# Altium project Arduino_VFO.PrjPcb
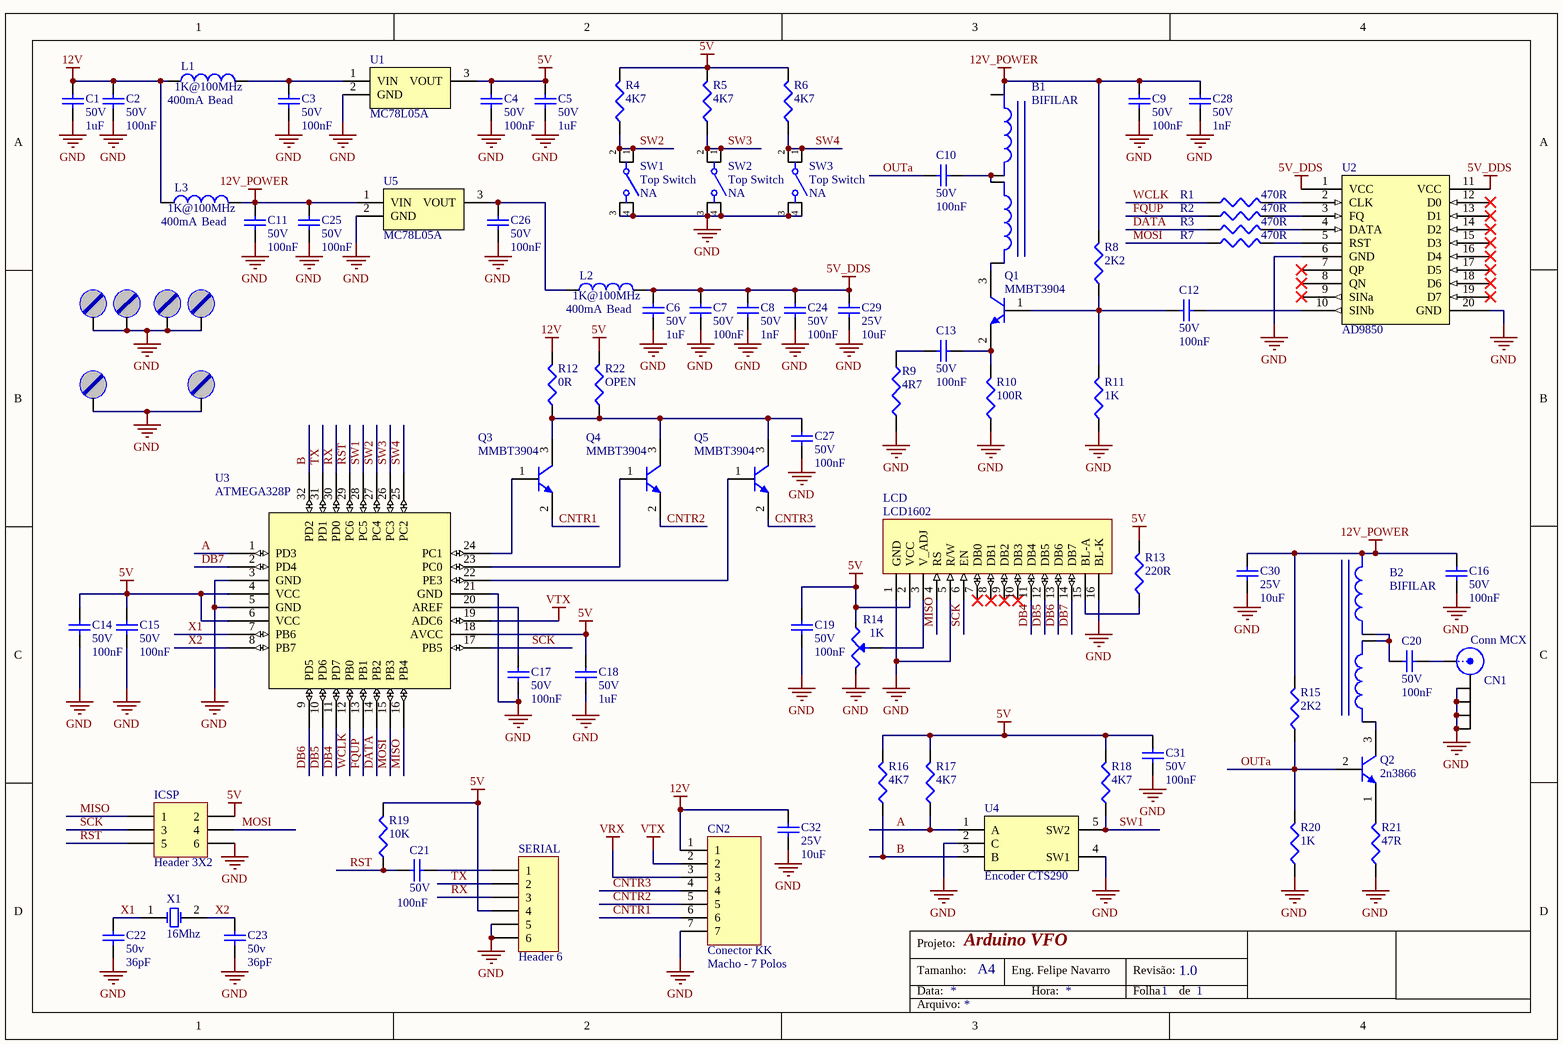
[diagram p0: Arduino.SchDoc]
1 sheet, 84 parts. Net scope: global (net labels, ports and power ports of the same name join across sheets).
Board file: Arduino_VFO.PcbDoc

## Sheet Arduino.SchDoc: Arduino VFO
size A4; Organization: Altium Limited; Address1: L3, 12a Rodborough Rd; Address2: Frenchs Forest; Address3: NSW; Address4: Australia 2086; Revision: 1.0; SheetNumber: 1; SheetTotal: 1

### Parts
B1  BIFILAR  [Toroid Bifilar]
B2  BIFILAR  [Toroid Bifilar]
C1  value 1uF  Tensão: 50V  [CC0603]  (hidden comment: Capacitor Cerâmico)
C2  value 100nF  Tensão: 50V  [CC0603]  (hidden comment: Capacitor Cerâmico)
C3  value 100nF  Tensão: 50V  [CC0603]  (hidden comment: Capacitor Cerâmico)
C4  value 100nF  Tensão: 50V  [CC0603]  (hidden comment: Capacitor Cerâmico)
C5  value 1uF  Tensão: 50V  [CC0603]  (hidden comment: Capacitor Cerâmico)
C6  value 1uF  Tensão: 50V  [CC0603]  (hidden comment: Capacitor Cerâmico)
C7  value 100nF  Tensão: 50V  [CC0603]  (hidden comment: Capacitor Cerâmico)
C8  value 1nF  Tensão: 50V  [CC0603]  (hidden comment: Capacitor Cerâmico)
C9  value 100nF  Tensão: 50V  [CC0603]  (hidden comment: Capacitor Cerâmico)
C10  value 100nF  Tensão: 50V  [CC0603]  (hidden comment: Capacitor Cerâmico)
C11  value 100nF  Tensão: 50V  [CC0603]  (hidden comment: Capacitor Cerâmico)
C12  value 100nF  Tensão: 50V  [CC0603]  (hidden comment: Capacitor Cerâmico)
C13  value 100nF  Tensão: 50V  [CC0603]  (hidden comment: Capacitor Cerâmico)
C14  value 100nF  Tensão: 50V  [CC0603]  (hidden comment: Capacitor Cerâmico)
C15  value 100nF  Tensão: 50V  [CC0603]  (hidden comment: Capacitor Cerâmico)
C16  value 100nF  Tensão: 50V  [CC0603]  (hidden comment: Capacitor Cerâmico)
C17  value 100nF  Tensão: 50V  [CC0603]  (hidden comment: Capacitor Cerâmico)
C18  value 1uF  Tensão: 50V  [CC0603]  (hidden comment: Capacitor Cerâmico)
C19  value 100nF  Tensão: 50V  [CC0603]  (hidden comment: Capacitor Cerâmico)
C20  value 100nF  Tensão: 50V  [CC0603]  (hidden comment: Capacitor Cerâmico)
C21  value 100nF  Tensão: 50V  [CC0603]  (hidden comment: Capacitor Cerâmico)
C22  value 36pF  Tensão: 50v  [CC0603]  (hidden comment: Capacitor Cerâmico)
C23  value 36pF  Tensão: 50v  [CC0603]  (hidden comment: Capacitor Cerâmico)
C24  value 100nF  Tensão: 50V  [CC0603]  (hidden comment: Capacitor Cerâmico)
C25  value 100nF  Tensão: 50V  [CC0603]  (hidden comment: Capacitor Cerâmico)
C26  value 100nF  Tensão: 50V  [CC0603]  (hidden comment: Capacitor Cerâmico)
C27  value 100nF  Tensão: 50V  [CC0603]  (hidden comment: Capacitor Cerâmico)
C28  value 1nF  Tensão: 50V  [CC0603]  (hidden comment: Capacitor Cerâmico)
C29  value 10uF  Tensão: 25V  [CC0805]  (hidden comment: Capacitor Cerâmico)
C30  value 10uF  Tensão: 25V  [CC0805]  (hidden comment: Capacitor Cerâmico)
C31  value 100nF  Tensão: 50V  [CC0603]  (hidden comment: Capacitor Cerâmico)
C32  value 10uF  Tensão: 25V  [CC0805]  (hidden comment: Capacitor Cerâmico)
CN1  Conn MCX  [CONN MCX MOLEX]
CN2  Conector KK  value Macho - 7 Polos  [CONN HDR7-POL P.100]
ICSP  Header 3X2  [CONN HDR2X3]
L1  Bead  value 1K@100MHz  Corrente: 400mA  [CC0603]
L2  Bead  value 1K@100MHz  Corrente: 400mA  [CC0603]
L3  Bead  value 1K@100MHz  Corrente: 400mA  [CC0603]
LCD  LCD1602  [LCD-1602]
M1  Furo de Fixação  [Furo_M3]  (value not drawn)  (no BOM)
M2  Furo de Fixação  [Furo_M3]  (value not drawn)  (no BOM)
M3  Furo de Fixação  [Furo_M3]  (value not drawn)  (no BOM)
M4  Furo de Fixação  [Furo_M3]  (value not drawn)  (no BOM)
M5  Furo de Fixação  [Furo_M3]  (value not drawn)  (no BOM)
M6  Furo de Fixação  [Furo_M3]  (value not drawn)  (no BOM)
Q1  MMBT3904  [SOT-23-3N]
Q2  2n3866  [TO-92R]
Q3  MMBT3904  [SOT-23-3N]
Q4  MMBT3904  [SOT-23-3N]
Q5  MMBT3904  [SOT-23-3N]
R1  value 470R  [CC0603]  (hidden comment: Resistor)
R2  value 470R  [CC0603]  (hidden comment: Resistor)
R3  value 470R  [CC0603]  (hidden comment: Resistor)
R4  value 4K7  [CC0603]  (hidden comment: Resistor)
R5  value 4K7  [CC0603]  (hidden comment: Resistor)
R6  value 4K7  [CC0603]  (hidden comment: Resistor)
R7  value 470R  [CC0603]  (hidden comment: Resistor)
R8  value 2K2  [CC0603]  (hidden comment: Resistor)
R9  value 4R7  [CC0603]  (hidden comment: Resistor)
R10  value 100R  [CC0603]  (hidden comment: Resistor)
R11  value 1K  [CC0603]  (hidden comment: Resistor)
R12  value 0R  [CC0603]  (hidden comment: Resistor)
R13  value 220R  [CC0603]  (hidden comment: Resistor)
R14  value 1K  [POT]  (hidden comment: Potenciômetro)
R15  value 2K2  [CC0603]  (hidden comment: Resistor)
R16  value 4K7  [CC0603]  (hidden comment: Resistor)
R17  value 4K7  [CC0603]  (hidden comment: Resistor)
R18  value 4K7  [CC0603]  (hidden comment: Resistor)
R19  value 10K  [CC0603]  (hidden comment: Resistor)
R20  value 1K  [CC0603]  (hidden comment: Resistor)
R21  value 47R  [CC0603]  (hidden comment: Resistor)
R22  value OPEN  [CC0603]  (hidden comment: Resistor)
SERIAL  Header 6  [CONN HDR1X6]
SW1  Top Switch  value NA  [SWITCH-TACTIL_6x6]
SW2  Top Switch  value NA  [SWITCH-TACTIL_6x6]
SW3  Top Switch  value NA  [SWITCH-TACTIL_6x6]
U1  MC78L05A  [SOT-89-3N]
U2  AD9850  [AD9850]
U3  ATMEGA328P  [TQFP-32N]
U4  Encoder CTS290  [ENCODER - CTS 290]
U5  MC78L05A  [SOT-89-3N]
X1  16Mhz  [HC/49US]

### Nets
5V: C4.2 C5.2 C14.2 C15.2 C18.2 C19.2 C31.2 ICSP.2 LCD.2(VCC) R4.2 R5.2 R6.2 R13.2 R14.1 R16.2 R17.2 R18.2 R19.2 R22.2 SERIAL.4 U1.3(VOUT) U3.4(VCC) U3.6(VCC) U3.18(AVCC)
5V_DDS: C6.2 C7.2 C8.2 C24.2 C29.2 L2.2 U2.1(VCC) U2.11(VCC)
12V: C1.2 C2.2 C32.2 CN2.1 L1.1 L3.1 R12.2
12V_POWER: B1.1(Pri+) B2.1(Pri+) C9.2 C11.2 C16.2 C25.2 C28.2 C30.2 L3.2 R8.2 R15.2 U5.1(VIN)
GND: C1.1 C2.1 C3.1 C4.1 C5.1 C6.1 C7.1 C8.1 C9.1 C11.1 C14.1 C15.1 C16.1 C17.1 C18.1 C19.1 C22.1 C23.1 C24.1 C25.1 C26.1 C27.1 C28.1 C29.1 C30.1 C31.1 C32.1 CN1.2(Y) CN1.3(Y) CN1.4(Y) CN1.5(Y) CN2.7 ICSP.6 LCD.1(GND) LCD.5(R/W) LCD.16(BL-K) M1.X M2.X M3.X M4.X M5.X M6.X R9.1 R10.1 R11.1 R14.3 R20.1 R21.1 SERIAL.5 SERIAL.6 SW1.3 SW1.4 SW2.3 SW2.4 SW3.3 SW3.4 U1.2(GND) U2.6(GND) U2.20(GND) U3.3(GND) U3.5(GND) U3.21(GND) U4.2(C) U4.4(SW1) U5.2(GND)
VRX: CN2.3
VTX: CN2.2 U3.19(ADC6)
A: R17.1 U3.1(PD3) U4.1(A)
B: R16.1 U3.32(PD2) U4.3(B)
CNTR1: CN2.6 Q3.2(E)
CNTR2: CN2.5 Q4.2(E)
CNTR3: CN2.4 Q5.2(E)
DATA: R3.1 U3.14(PB2)
DB4: LCD.11(DB4) U3.11(PD7)
DB5: LCD.12(DB5) U3.10(PD6)
DB6: LCD.13(DB6) U3.9(PD5)
DB7: LCD.14(DB7) U3.2(PD4)
FQUP: R2.1 U3.13(PB1)
MISO: ICSP.1 LCD.4(RS) U3.16(PB4)
MOSI: ICSP.4 R7.1 U3.15(PB3)
OUTa: C10.2 Q2.2(B) R15.1 R20.2
RST: C21.2 ICSP.5 R19.1 U3.29(PC6)
RX: SERIAL.3 U3.30(PD0)
SCK: ICSP.3 LCD.6(EN) U3.17(PB5)
SW1: R18.1 U3.28(PC5) U4.5(SW2)
SW2: R4.1 SW1.1 SW1.2 U3.27(PC4)
SW3: R5.1 SW2.1 SW2.2 U3.26(PC3)
SW4: R6.1 SW3.1 SW3.2 U3.25(PC2)
TX: SERIAL.2 U3.31(PD1)
WCLK: R1.1 U3.12(PB0)
X1: C22.2 U3.7(PB6) X1.1(OSC1)
X2: C23.2 U3.8(PB7) X1.2(OSC2)
NetB1_2: B1.2(Sec-) B1.3(Sec+) C10.1
NetB1_4: B1.4(Pri-) Q1.3(C)
NetB2_2: B2.2(Sec-) B2.3(Sec+) C20.2
NetB2_4: B2.4(Pri-) Q2.3(C)
NetC3_2: C3.2 L1.2 U1.1(VIN)
NetC12_1: C12.1 U2.10(SINb)
NetC12_2: C12.2 Q1.1(B) R8.1 R11.2
NetC13_1: C13.1 R9.2
NetC13_2: C13.2 Q1.2(E) R10.2
NetC17_2: C17.2 U3.20(AREF)
NetC20_1: C20.1 CN1.1(X)
NetC21_1: C21.1 SERIAL.1
NetC26_2: C26.2 L2.1 U5.3(VOUT)
NetC27_2: C27.2 Q3.3(C) Q4.3(C) Q5.3(C) R12.1 R22.1
NetLCD_3: LCD.3(V_ADJ) R14.2(TAP)
NetLCD_15: LCD.15(BL-A) R13.1
NetQ2_1: Q2.1(E) R21.2
NetQ3_1: Q3.1(B) U3.24(PC1)
NetQ4_1: Q4.1(B) U3.23(PC0)
NetQ5_1: Q5.1(B) U3.22(PE3)
NetR1_2: R1.2 U2.2(CLK)
NetR2_2: R2.2 U2.3(FQ)
NetR3_2: R3.2 U2.4(DATA)
NetR7_2: R7.2 U2.5(RST)

Not connected (* = marked no-connect by the designer): LCD 7(DB0)* 8(DB1)* 9(DB2)* 10(DB3)*; U2 7(QP)* 8(QN)* 9(SINa)* 12(D0)* 13(D1)* 14(D2)* 15(D3)* 16(D4)* 17(D5)* 18(D6)* 19(D7)*

### Notes on the sheet
- Projeto:
- Tamanho:
- Data:
- A4
- Eng. Felipe Navarro
- Hora:
- Revisão:
- Folha
- de
- Arquivo:

### Library data of the parts
B1 B2 = Toroid Bifilar: ChinesePrice: 0,00000; Chinês: ----; Corrente: *; Potência: *; Supplier 1: Digi-Key; Supplier Part Number 1: *; Tensão: *; Obs:: *; Tolerância: *; ComponentLink1Description: Datasheet; ComponentLink1URL: D:\Tecnoclade\Datasheet\!DataMissing.pdf; Substituição: 00/00/0000; Value: *
C1 C5 C6 C18 = Cap 1uF 50V 0603 X5R: Capacitor (Semiconductor SIM Model); Chinês: Local; ChinesePrice: 0,01100; Corrente: *A; Potência: *W; Obs:: X5R; Tolerância: ±10%; Supplier 1: Digi-Key; Supplier Part Number 1: 587-2400-1-ND; ComponentLink1Description: Datasheet; ComponentLink1URL: D:\Tecnoclade\Datasheet\!DataMissing.pdf
C2-C4 C7 C9-C17 C19-C21 C24-C28 C31 = Cap 100nF 50V 0603 X7R: Capacitor (Semiconductor SIM Model); Chinês: Local; ChinesePrice: 0,00250; Corrente: *A; Potência: *W; Obs:: X7R; Tolerância: ±10%; Supplier 1: Digi-Key; Supplier Part Number 1: 1276-1000-1-ND; ComponentLink1Description: Datasheet; ComponentLink1URL: D:\Tecnoclade\Datasheet\!DataMissing.pdf
C8 = Cap 1nF 50V 0603 NP0: Capacitor (Semiconductor SIM Model); Chinês: Local; ChinesePrice: 0,00700; Corrente: *A; Potência: *W; Obs:: NP0; Tolerância: ±5%; Supplier 1: Digi-Key; Supplier Part Number 1: 490-1451-1-ND; ComponentLink1Description: Datasheet; ComponentLink1URL: D:\Tecnoclade\Datasheet\!DataMissing.pdf
C22 C23 = Cap - $Val $V $Footprint $Classe_1: Capacitor (Semiconductor SIM Model); Chinês: ----; ChinesePrice: 0,00000; Corrente: *A; Potência: *W; Tolerância: ±*%; Supplier 1: Digi-Key; Supplier Part Number 1: 1276-1187-1-ND; Obs:: *; ComponentLink1Description: Datasheet; ComponentLink1URL: D:\Tecnoclade\Datasheet\!DataMissing.pdf
C29 C30 C32 = Cap 10uF 25V 0805 X5R: Capacitor (Semiconductor SIM Model); Chinês: Local; ChinesePrice: 0,02620; Corrente: *A; Potência: *W; Obs:: X5R; Tolerância: ±10%; Supplier 1: Digi-Key; Supplier Part Number 1: 587-2985-1-ND; ComponentLink1Description: Datasheet; ComponentLink1URL: D:\Tecnoclade\Datasheet\!DataMissing.pdf
CN1 = Conn MCX: Conector MCX; ChinesePrice: 0,00000; Chinês: ----; Value: SMA; Corrente: *; Potência: *; Supplier 1: Digi-Key; Supplier Part Number 1: WM5541-ND; Tensão: *; Obs:: *; Tolerância: *; ComponentLink1Description: Datasheet; ComponentLink1URL: D:\Tecnoclade\Datasheet\!DataMissing.pdf
CN2 = KK 7P Macho-V P2.54mm: ChinesePrice: 0,00000; Chinês: ----; Corrente: *; Potência: *; Supplier 1: Digi-Key; Supplier Part Number 1: A19472-ND; Tensão: *; Obs:: *; Tolerância: *; ComponentLink1Description: Datasheet; ComponentLink1URL: D:\Tecnoclade\Datasheet\!DataMissing.pdf
ICSP = Header 3X2: Header, 5-Pin, Dual row; ChinesePrice: 0,00000; Chinês: ----; Value: Macho; Obs:: Barra dupla de 40 pinos - ATENÇÃO; Corrente: *; Potência: *; Supplier 1: Digi-Key; Supplier Part Number 1: 609-3724-ND; Tensão: *; Tolerância: *; ComponentLink1Description: Datasheet; ComponentLink1URL: D:\Tecnoclade\Datasheet\!DataMissing.pdf
L1-L3 = Bd 1K@100MHz 0603 400mA: ChinesePrice: 0,00000; Chinês: -----; Obs:: Ferrite (0R5); Tolerância: ±25%; Potência: *; Supplier 1: Digi-Key; Supplier Part Number 1: 445-1550-1-ND; Tensão: *; ComponentLink1Description: Datasheet; ComponentLink1URL: D:\Tecnoclade\Datasheet\!DataMissing.pdf; Substituição: 27/06/2014
LCD = LCD1602: LCD Generico 16 caracteres X 2 linhas; ChinesePrice: 0,00000; Chinês: ----; Tensão: -0V3 ~ 7V; Value: Display LCD de LED; Obs:: BackLigth = 3V ~ 11V (5V recomendado); Corrente: *; Potência: *; Supplier 1: Digi-Key; Supplier Part Number 1: --LCD; Tolerância: *; ComponentLink1Description: Datasheet; ComponentLink1URL: D:\Tecnoclade\Datasheet\
M1-M6 = Parafuso: Furo para parafuso; Value: M3; ChinesePrice: 0,00000; Chinês: ----; Supplier 1: Digi-Key; Supplier Part Number 1: --Del; Corrente: *; Potência: *; Tensão: *; Tolerância: *; Obs:: *; ComponentLink1Description: Datasheet; ComponentLink1URL: D:\Tecnoclade\Datasheet\!DataMissing.pdf
Q1 Q3-Q5 = TRS MMBT3904 40V 200mA SOT-23-3N: NPN General Purpose Amplifier; Tensão: 40V; Corrente: 600mA; Potência: 350mW; Chinês: ----; ChinesePrice: 0,00000; Value: 300MHz; Supplier 1: Digi-Key; Supplier Part Number 1: 568-4510-1-ND; Obs:: *; Tolerância: *; ComponentLink1Description: Datasheet; ComponentLink1URL: D:\Tecnoclade\Datasheet\!DataMissing.pdf
Q2 = TRS BC108 TO-18: NPN General Purpose Amplifier; Tensão: 40V; Corrente: 200mA; Potência: 250mW; Chinês: ----; ChinesePrice: 0,00000; Value: 300MHz; Supplier 1: Digi-Key; Obs:: *; Tolerância: *; ComponentLink1Description: Datasheet; ComponentLink1URL: D:\Tecnoclade\Datasheet\!DataMissing.pdf
R1-R3 R7 = Res 470R 5% 0603 1/10W: ChinesePrice: 0,00000; Chinês: ----; Corrente: *A; Potência: 1/10W; Tensão: *V; Obs: ±200ppm/ºC; Tolerância: ±5%; Supplier 1: Digi-Key; Supplier Part Number 1: RMCF0603JT470RCT-ND; ComponentLink1Description: Datasheet; ComponentLink1URL: D:\Tecnoclade\Datasheet\!DataMissing.pdf
R4-R6 R16-R18 = Res 4K7 1% 0603 1/10W: ChinesePrice: 0,00000; Chinês: ----; Corrente: *A; Potência: 1/10W; Tensão: *V; Obs: ±100ppm/ºC; Tolerância: ±1%; Supplier 1: Digi-Key; Supplier Part Number 1: RMCF0603FT4K70CT-ND; ComponentLink1Description: Datasheet; ComponentLink1URL: D:\Tecnoclade\Datasheet\!DataMissing.pdf
R8 R15 = Res 2K2 5% 0603 1/10W: ChinesePrice: 0,00000; Chinês: ----; Corrente: *A; Potência: 1/10W; Tensão: *V; Obs: ±200ºC/ppm; Tolerância: ±5%; Supplier 1: Digi-Key; Supplier Part Number 1: RMCF0603JT2K20CT-ND; ComponentLink1Description: Datasheet; ComponentLink1URL: D:\Tecnoclade\Datasheet\!DataMissing.pdf
R9 = Res 4R7 1% 0603 1/10W: ChinesePrice: 0,00000; Chinês: ----; Corrente: *A; Potência: 1/10W; Tensão: *V; Tolerância: ±*%; Supplier 1: Digi-Key; Supplier Part Number 1: 311-4.7GRCT-ND; Obs:: *; ComponentLink1Description: Datasheet; ComponentLink1URL: D:\Tecnoclade\Datasheet\!DataMissing.pdf
R10 = Res 100R 5% 0603 1/10W: ChinesePrice: 0,00080; Chinês: Local; Corrente: *A; Potência: 1/10W; Tensão: *V; Tolerância: ±5%; Supplier 1: Digi-Key; Supplier Part Number 1: RMCF0603JT100RCT-ND; Obs: *; ComponentLink1Description: Datasheet; ComponentLink1URL: D:\Tecnoclade\Datasheet\!DataMissing.pdf
R11 R20 = Res 1K 1% 0603 1/10W: ChinesePrice: 0,00089; Chinês: Local; Corrente: *A; Potência: 1/10W; Tensão: *V; Tolerância: ±1%; Supplier 1: Digi-Key; Supplier Part Number 1: RMCF0603FT1K00CT-ND; Obs: *; ComponentLink1Description: Datasheet; ComponentLink1URL: D:\Tecnoclade\Datasheet\!DataMissing.pdf
R12 R22 = Res 0R 0603 1/10W: ChinesePrice: 0,00089; Chinês: Local; Corrente: *A; Potência: 1/10W; Tensão: *V; Tolerância: Jumper; Supplier 1: Digi-Key; Supplier Part Number 1: P0.0GCT-ND; Obs: *; ComponentLink1Description: Datasheet; ComponentLink1URL: D:\Tecnoclade\Datasheet\!DataMissing.pdf
R13 = Res 220R 1% 0603 1/10W: ChinesePrice: 0,00000; Chinês: ----; Corrente: *A; Potência: 1/10W; Tensão: *V; Obs: ±100ppm/ºC; Tolerância: ±1%; Supplier 1: Digi-Key; Supplier Part Number 1: RMCF0603FT220RCT-ND; ComponentLink1Description: Datasheet; ComponentLink1URL: D:\Tecnoclade\Datasheet\!DataMissing.pdf
R14 = Res Pot: Potenciometro; ChinesePrice: 0,00000; Chinês: ----; Corrente: *A; Potência: *W; Tensão: *V; Tolerância: ±*%; Supplier 1: Digi-Key; Supplier Part Number 1: --Del; Obs: *; ComponentLink1Description: Datasheet; ComponentLink1URL: D:\Tecnoclade\Datasheet\!DataMissing.pdf
R19 = Res 10K 1% 0603 1/10W: ChinesePrice: 0,00089; Chinês: Local; Corrente: *A; Potência: 1/10W; Tensão: *V; Tolerância: ±1%; Supplier 1: Digi-Key; Supplier Part Number 1: P10.0KHCT-ND; Obs: *; ComponentLink1Description: Datasheet; ComponentLink1URL: D:\Tecnoclade\Datasheet\!DataMissing.pdf
R21 = Res 47K 1% 0603 1/10W: ChinesePrice: 0,00089; Chinês: Local; Corrente: *A; Potência: 1/10W; Tensão: *V; Obs: ±100ppm/ºC; Tolerância: ±1%; Supplier 1: Digi-Key; Supplier Part Number 1: *; ComponentLink1Description: Datasheet; ComponentLink1URL: D:\Tecnoclade\Datasheet\!DataMissing.pdf
SERIAL = Header 6: Header, 6-Pin; ChinesePrice: 0,10000; Chinês: Proved - Local; Value: Barra de 40 pinos - ATENÇÃO; Corrente: *; Potência: *; Supplier 1: Digi-Key; Supplier Part Number 1: A26509-40-ND; Tensão: *; Obs:: *; Tolerância: *; ComponentLink1Description: Datasheet; ComponentLink1URL: D:\Tecnoclade\Datasheet\!DataMissing.pdf
SW1-SW3 = SW-SPST Tactil: Single-Pole, Single-Throw Switch; Corrente: 50mA; Tensão: 12V; ChinesePrice: 0,03000; Chinês: Local; Obs:: Atuador = 13mm(h) X 6mm (dia); Supplier 1: Digi-Key; Supplier Part Number 1: 450-1642-ND; Potência: *; Tolerância: *; ComponentLink1Description: Datasheet; ComponentLink1URL: D:\Tecnoclade\Datasheet\!DataMissing.pdf
U1 U5 = MC78L05: Regulador Linear 5V; Chinês: -----; Corrente: 100mA; ChinesePrice: 0,00000; Potência: *; Value: *; Supplier 1: Digi-Key; Supplier Part Number 1: MC78L05ACHXCT-ND; Tensão: 5V; Obs:: *; Tolerância: *; ComponentLink1Description: Datasheet; ComponentLink1URL: D:\Tecnoclade\Datasheet\
U2 = AD9850: DDS AD9850 Module; ChinesePrice: 0,00000; Chinês: ----; Corrente: *; Potência: *; Tensão: *; Value: *; Supplier 1: Digi-Key; Supplier Part Number 1: *; Obs:: *; Tolerância: *; ComponentLink1Description: Datasheet; ComponentLink1URL: D:\Tecnoclade\Datasheet\
U3 = ATMEGA328P: IC MCU 32KB FLASH 20MHZ 32TQFP; ChinesePrice: 0,00000; Chinês: ----; Supplier 1: Digi-Key; Supplier Part Number 1: ATMEGA328P-AN-ND; Tensão: *; Corrente: *; Potência: *; Value: *; Obs:: *; Tolerância: *; ComponentLink1Description: Datasheet; ComponentLink1URL: D:\Tecnoclade\Datasheet\
U4 = Encoder CTS 290: Memória; ChinesePrice: 1,94000; Chinês: Local; Corrente: *; Potência: *; Supplier 1: Digi-Key; Supplier Part Number 1: CT3006-ND; Tensão: *; Value: *; Obs:: *; Tolerância: *; ComponentLink1Description: Datasheet; ComponentLink1URL: D:\Tecnoclade\Datasheet\!DataMissing.pdf
X1 = XTAL: Crystal Oscillator; ChinesePrice: 0,00000; Chinês: ----; Value: 20pF/40R; Corrente: *; Potência: *; Supplier 1: Digi-Key; Supplier Part Number 1: 535-10226-1-ND; Tensão: *; Obs:: *; Tolerância: *